# EAGLE design bd950_interface (EAGLE 7.7.0)

## Sheet 1 of 3
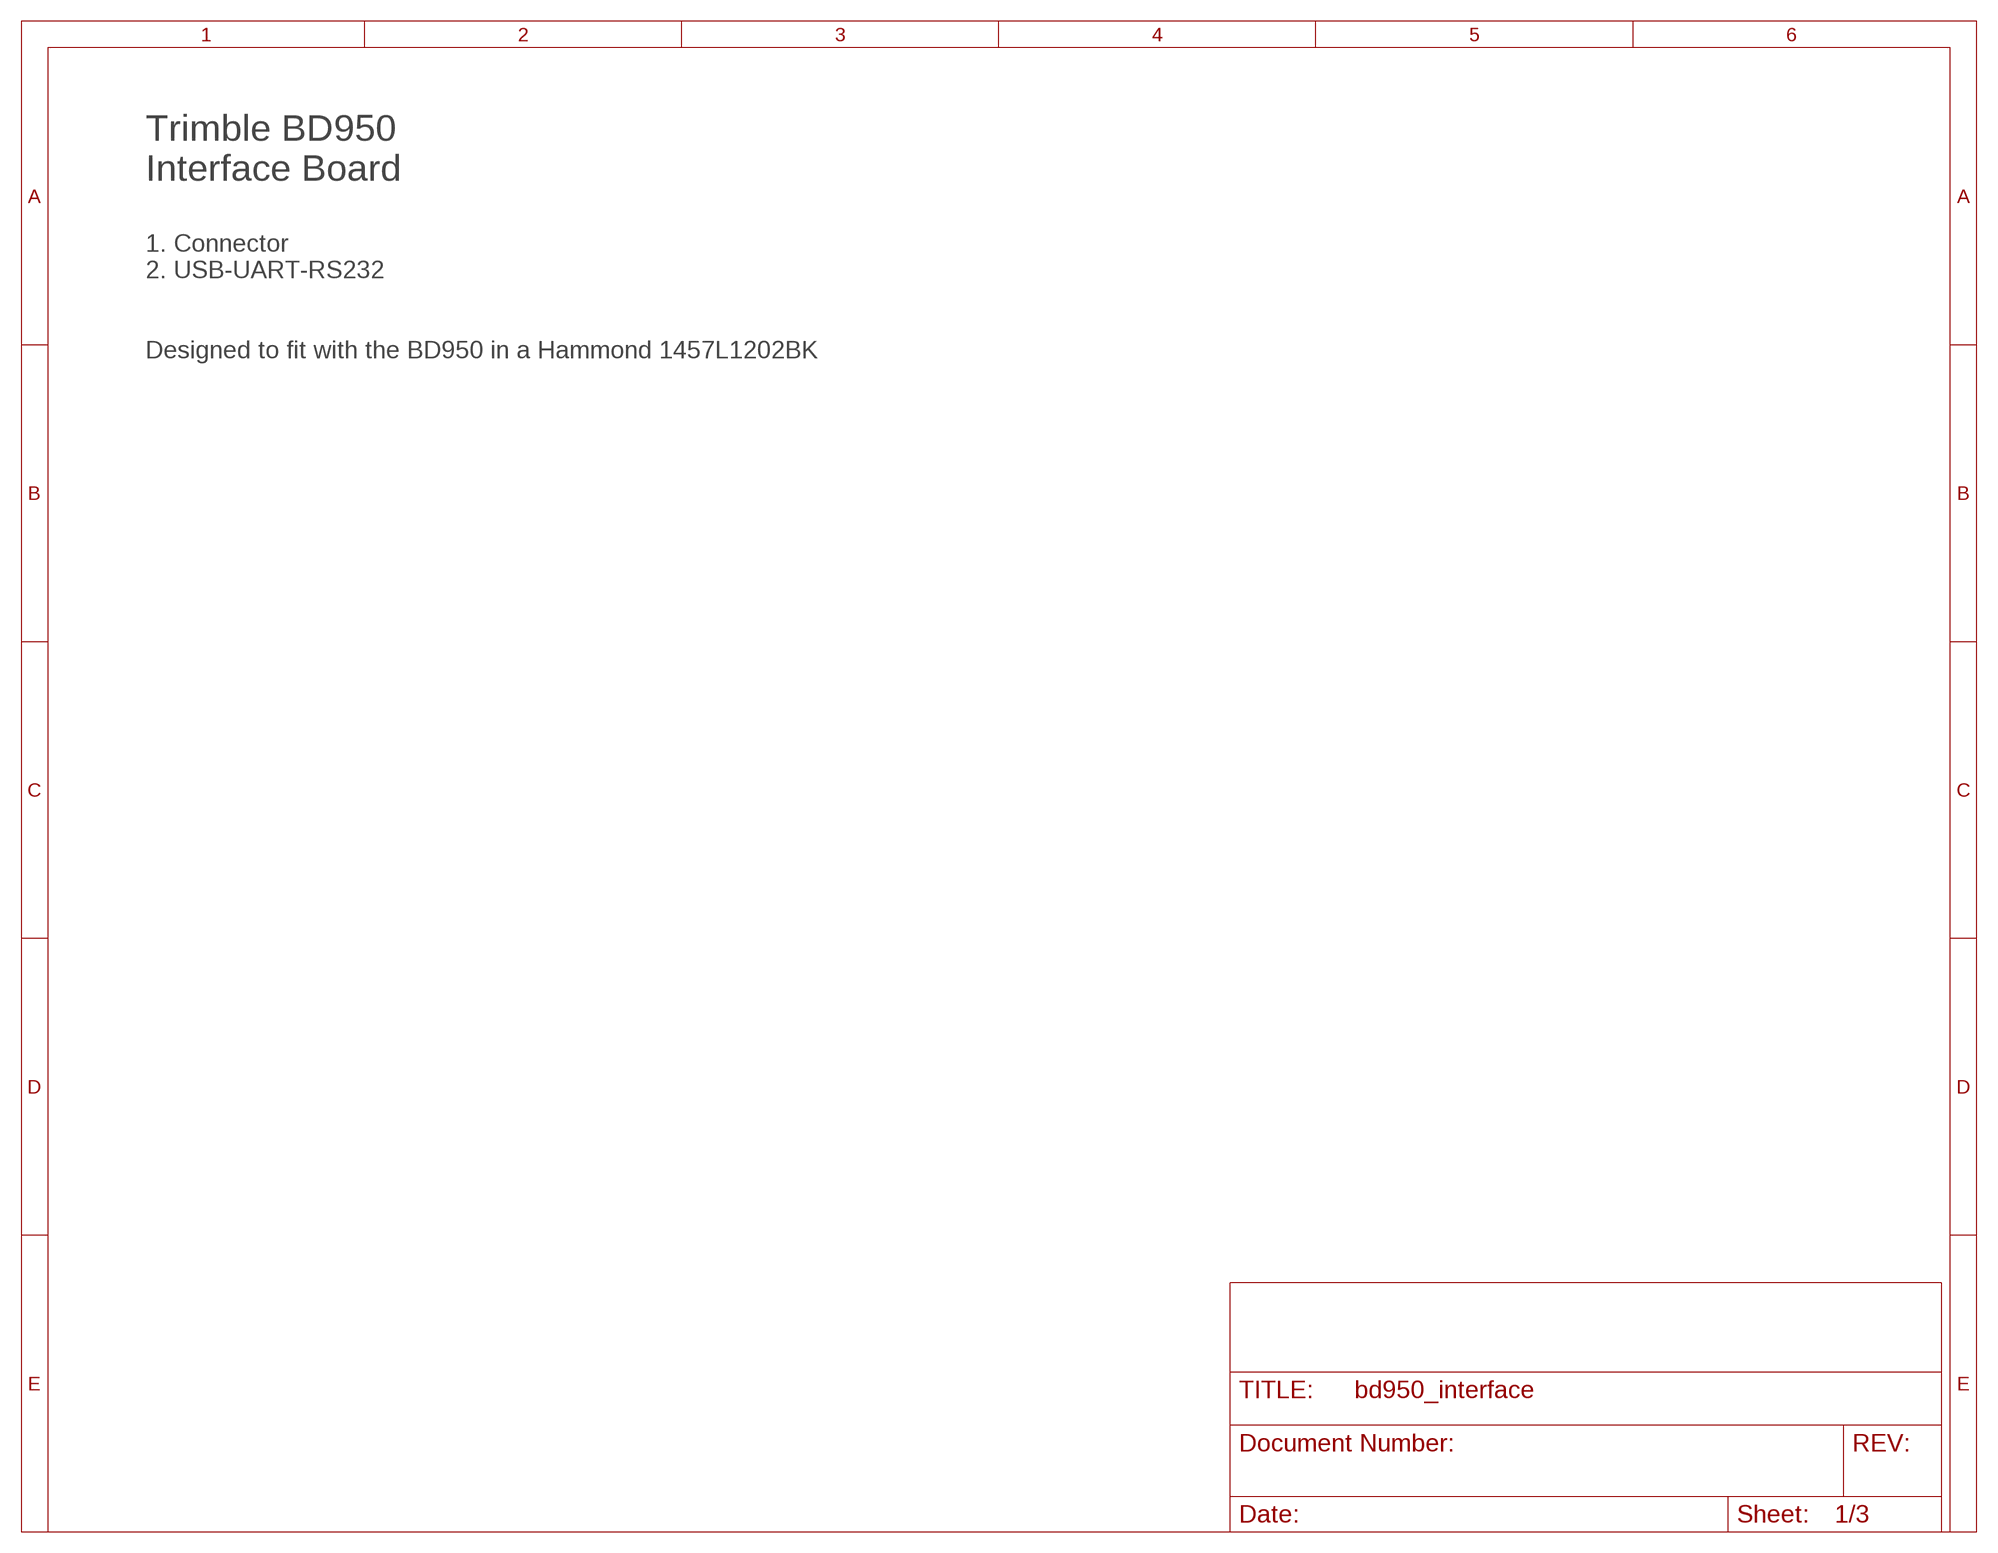
[diagram p0: schematic, sheet 1]

### Notes on the sheet
- Trimble BD950
  Interface Board
- 1. Connector
  2. USB-UART-RS232
- Designed to fit with the BD950 in a Hammond 1457L1202BK

## Sheet 2 of 3
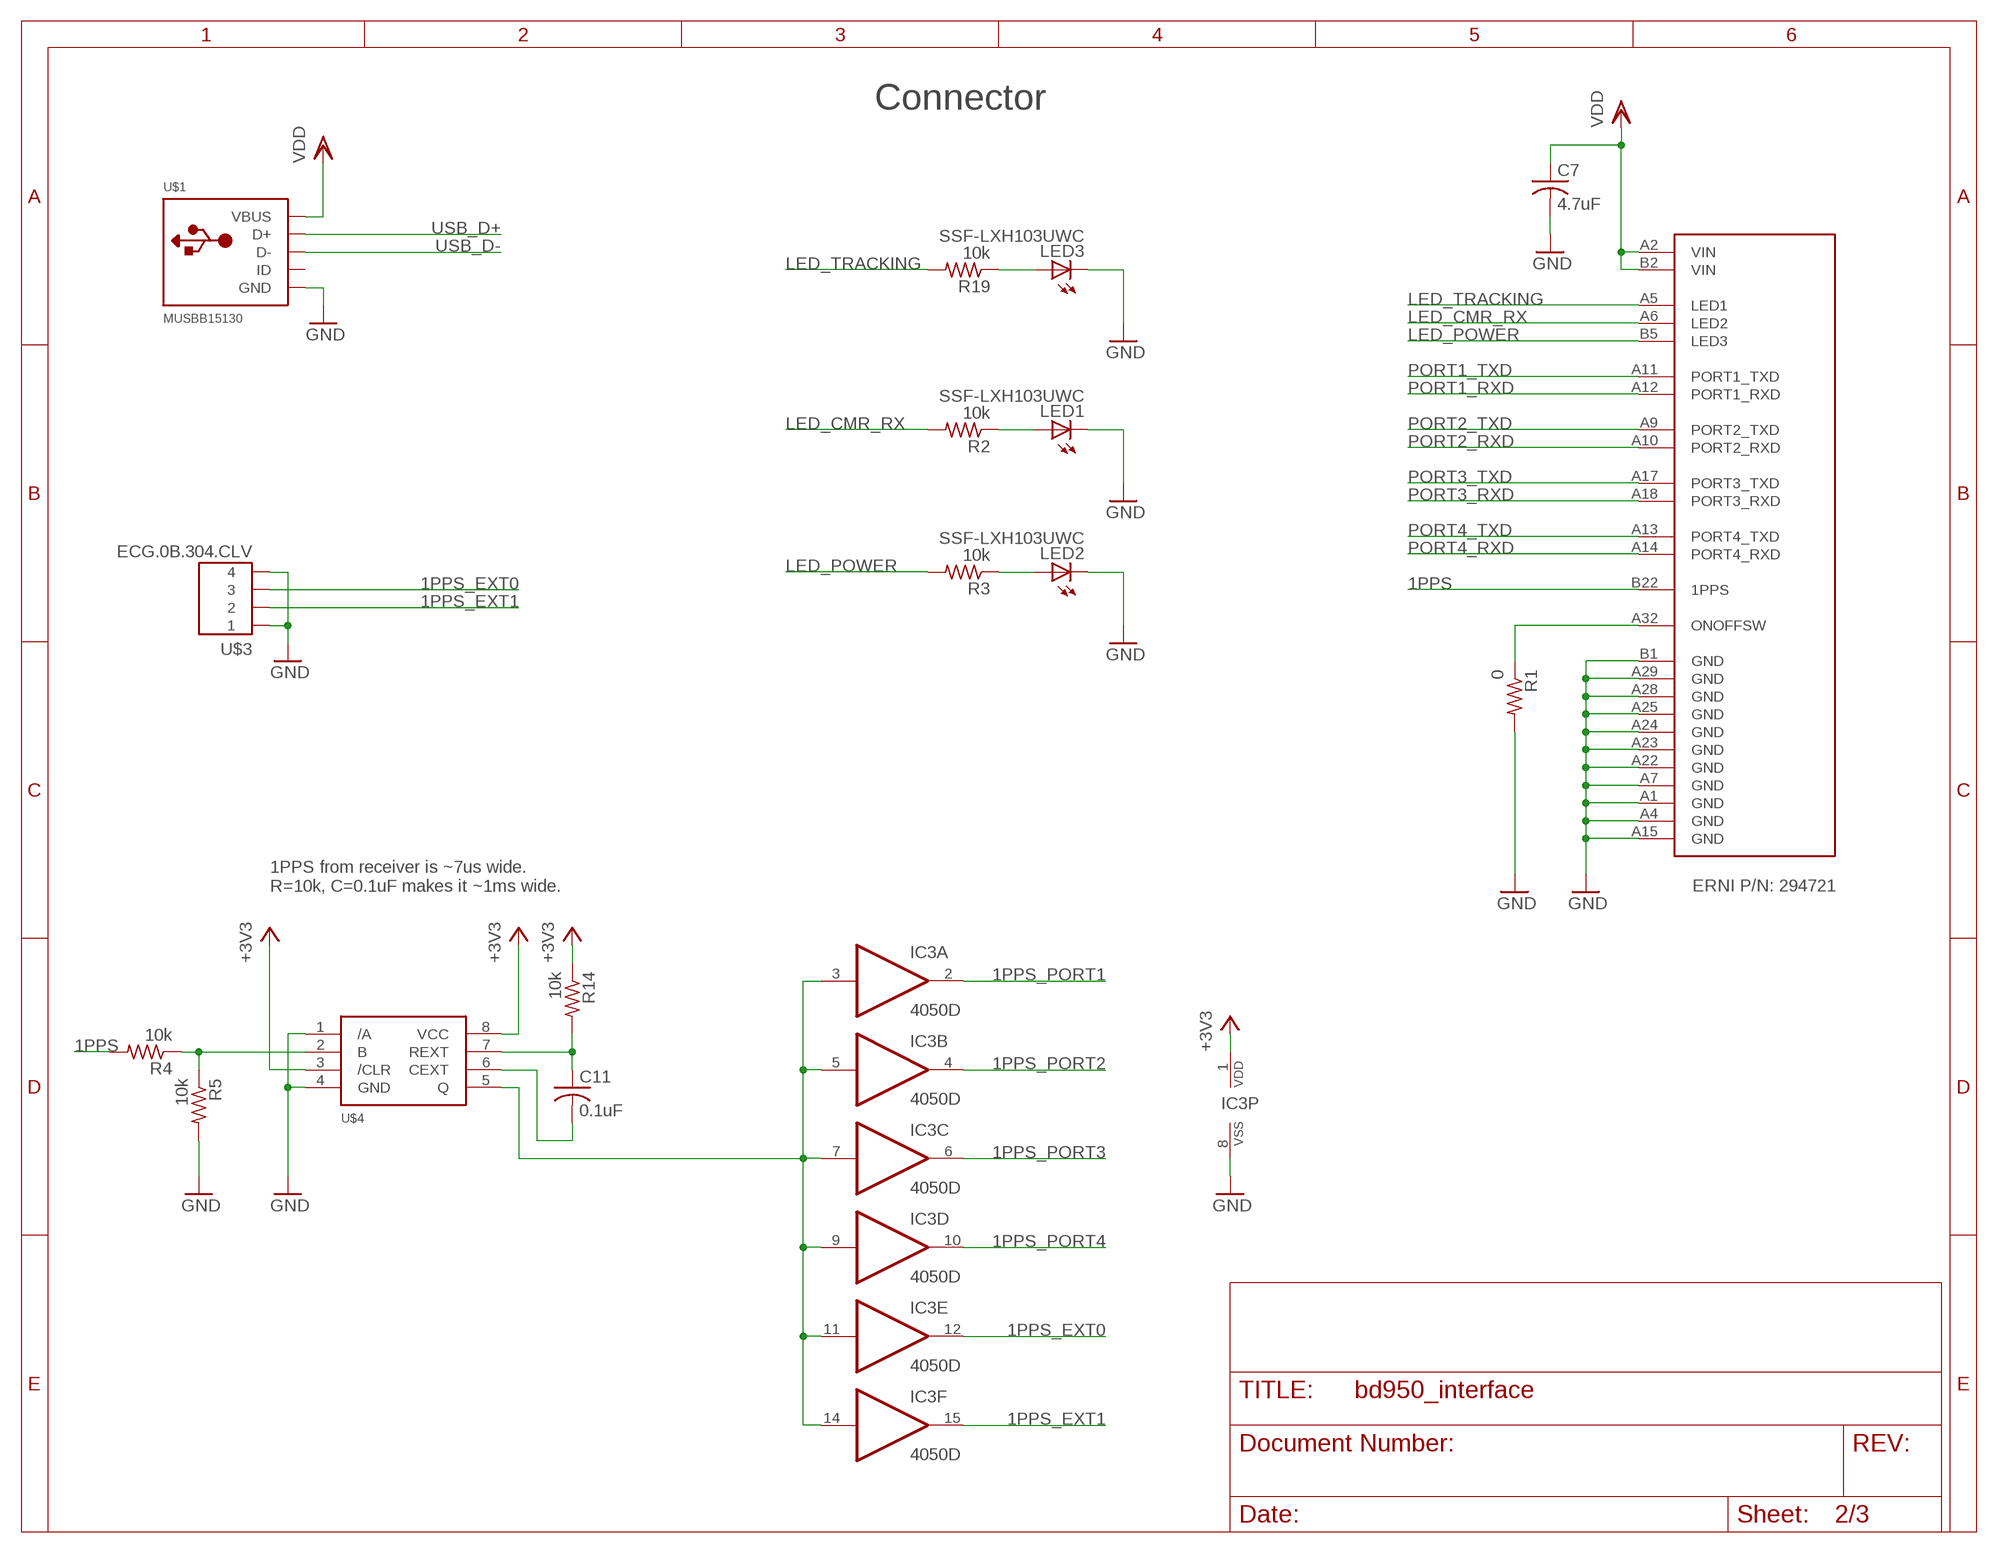
[diagram p1: schematic, sheet 2]

### Parts
C7  4.7uF  C-USC0805  [C0805]
C11  0.1uF  C-USC0603  [C0603]
IC3  4050D  [SO16]
LED1  SSF-LXH103UWC  LEDCHIP-LED0603  [CHIP-LED0603]
LED2  SSF-LXH103UWC  LEDCHIP-LED0603  [CHIP-LED0603]
LED3  SSF-LXH103UWC  LEDCHIP-LED0603  [CHIP-LED0603]
R1  0  R-US_R0603  [R0603]
R2  10k  R-US_R0603  [R0603]
R3  10k  R-US_R0603  [R0603]
R4  10k  R-US_R0603  [R0603]
R5  10k  R-US_R0603  [R0603]
R14  10k  R-US_R0603  [R0603]
R19  10k  R-US_R0603  [R0603]
U$1  MUSBB15130  [MUSBB15130]
U$2  294721  TRIMBLE_BD950  [TRIMBLE_BD950]
U$3  ECG.0B.304.CLV  ECG.0B.CLV  [ECG.0B.CLV]
U$4  SN74LVC1G123  [DCU_(R-PDSO-G8)]

### Nets
1PPS: R4.2 U$2.B22(1PPS)
1PPS_EXT0: IC3.12(E:O) U$3.P$4
1PPS_EXT1: IC3.15(F:O) U$3.P$3
1PPS_PORT1: IC3.2(A:O) ; also sheet 3
1PPS_PORT2: IC3.4(B:O) ; also sheet 3
1PPS_PORT3: IC3.6(C:O) ; also sheet 3
1PPS_PORT4: IC3.10(D:O) ; also sheet 3
+3V3: IC3.1(P:VDD) R14.1 U$4.3(/CLR) U$4.8(VCC) ; also sheet 3
GND: C7.2 IC3.8(P:VSS) LED1.C LED2.C LED3.C R1.2 R5.2 U$1.5(GND) U$2.A1(GND) U$2.A4(GND) U$2.A7(GND) U$2.A15(GND) U$2.A22(GND) U$2.A23(GND) U$2.A24(GND) U$2.A25(GND) U$2.A28(GND) U$2.A29(GND) U$2.B1(GND) U$3.P$1 U$3.P$2 U$4.1(/A) U$4.4(GND) ; also sheet 3
LED_CMR_RX: R2.2 U$2.A6(LED2)
LED_POWER: R3.2 U$2.B5(LED3)
LED_TRACKING: R19.2 U$2.A5(LED1)
N$1: LED1.A R2.1
N$3: R1.1 U$2.A32(ONOFFSW)
N$5: LED2.A R3.1
N$7: LED3.A R19.1
N$8: IC3.3(A:I) IC3.5(B:I) IC3.7(C:I) IC3.9(D:I) IC3.11(E:I) IC3.14(F:I) U$4.5(Q)
N$13: R4.1 R5.1 U$4.2(B)
N$21: C11.2 U$4.6(CEXT)
N$23: C11.1 R14.2 U$4.7(REXT)
PORT1_RXD: U$2.A12(PORT1_RXD) ; also sheet 3
PORT1_TXD: U$2.A11(PORT1_TXD) ; also sheet 3
PORT2_RXD: U$2.A10(PORT2_RXD) ; also sheet 3
PORT2_TXD: U$2.A9(PORT2_TXD) ; also sheet 3
PORT3_RXD: U$2.A18(PORT3_RXD) ; also sheet 3
PORT3_TXD: U$2.A17(PORT3_TXD) ; also sheet 3
PORT4_RXD: U$2.A14(PORT4_RXD) ; also sheet 3
PORT4_TXD: U$2.A13(PORT4_TXD) ; also sheet 3
USB_D+: U$1.3(D+) ; also sheet 3
USB_D-: U$1.2(D-) ; also sheet 3
VDD: C7.1 U$1.1(VBUS) U$2.A2(VIN) U$2.B2(VIN) ; also sheet 3
Unconnected: U$1.4(ID)

### Notes on the sheet
- Connector
- 1PPS from receiver is ~7us wide.
  R=10k, C=0.1uF makes it ~1ms wide.
- ERNI P/N: 294721

## Sheet 3 of 3
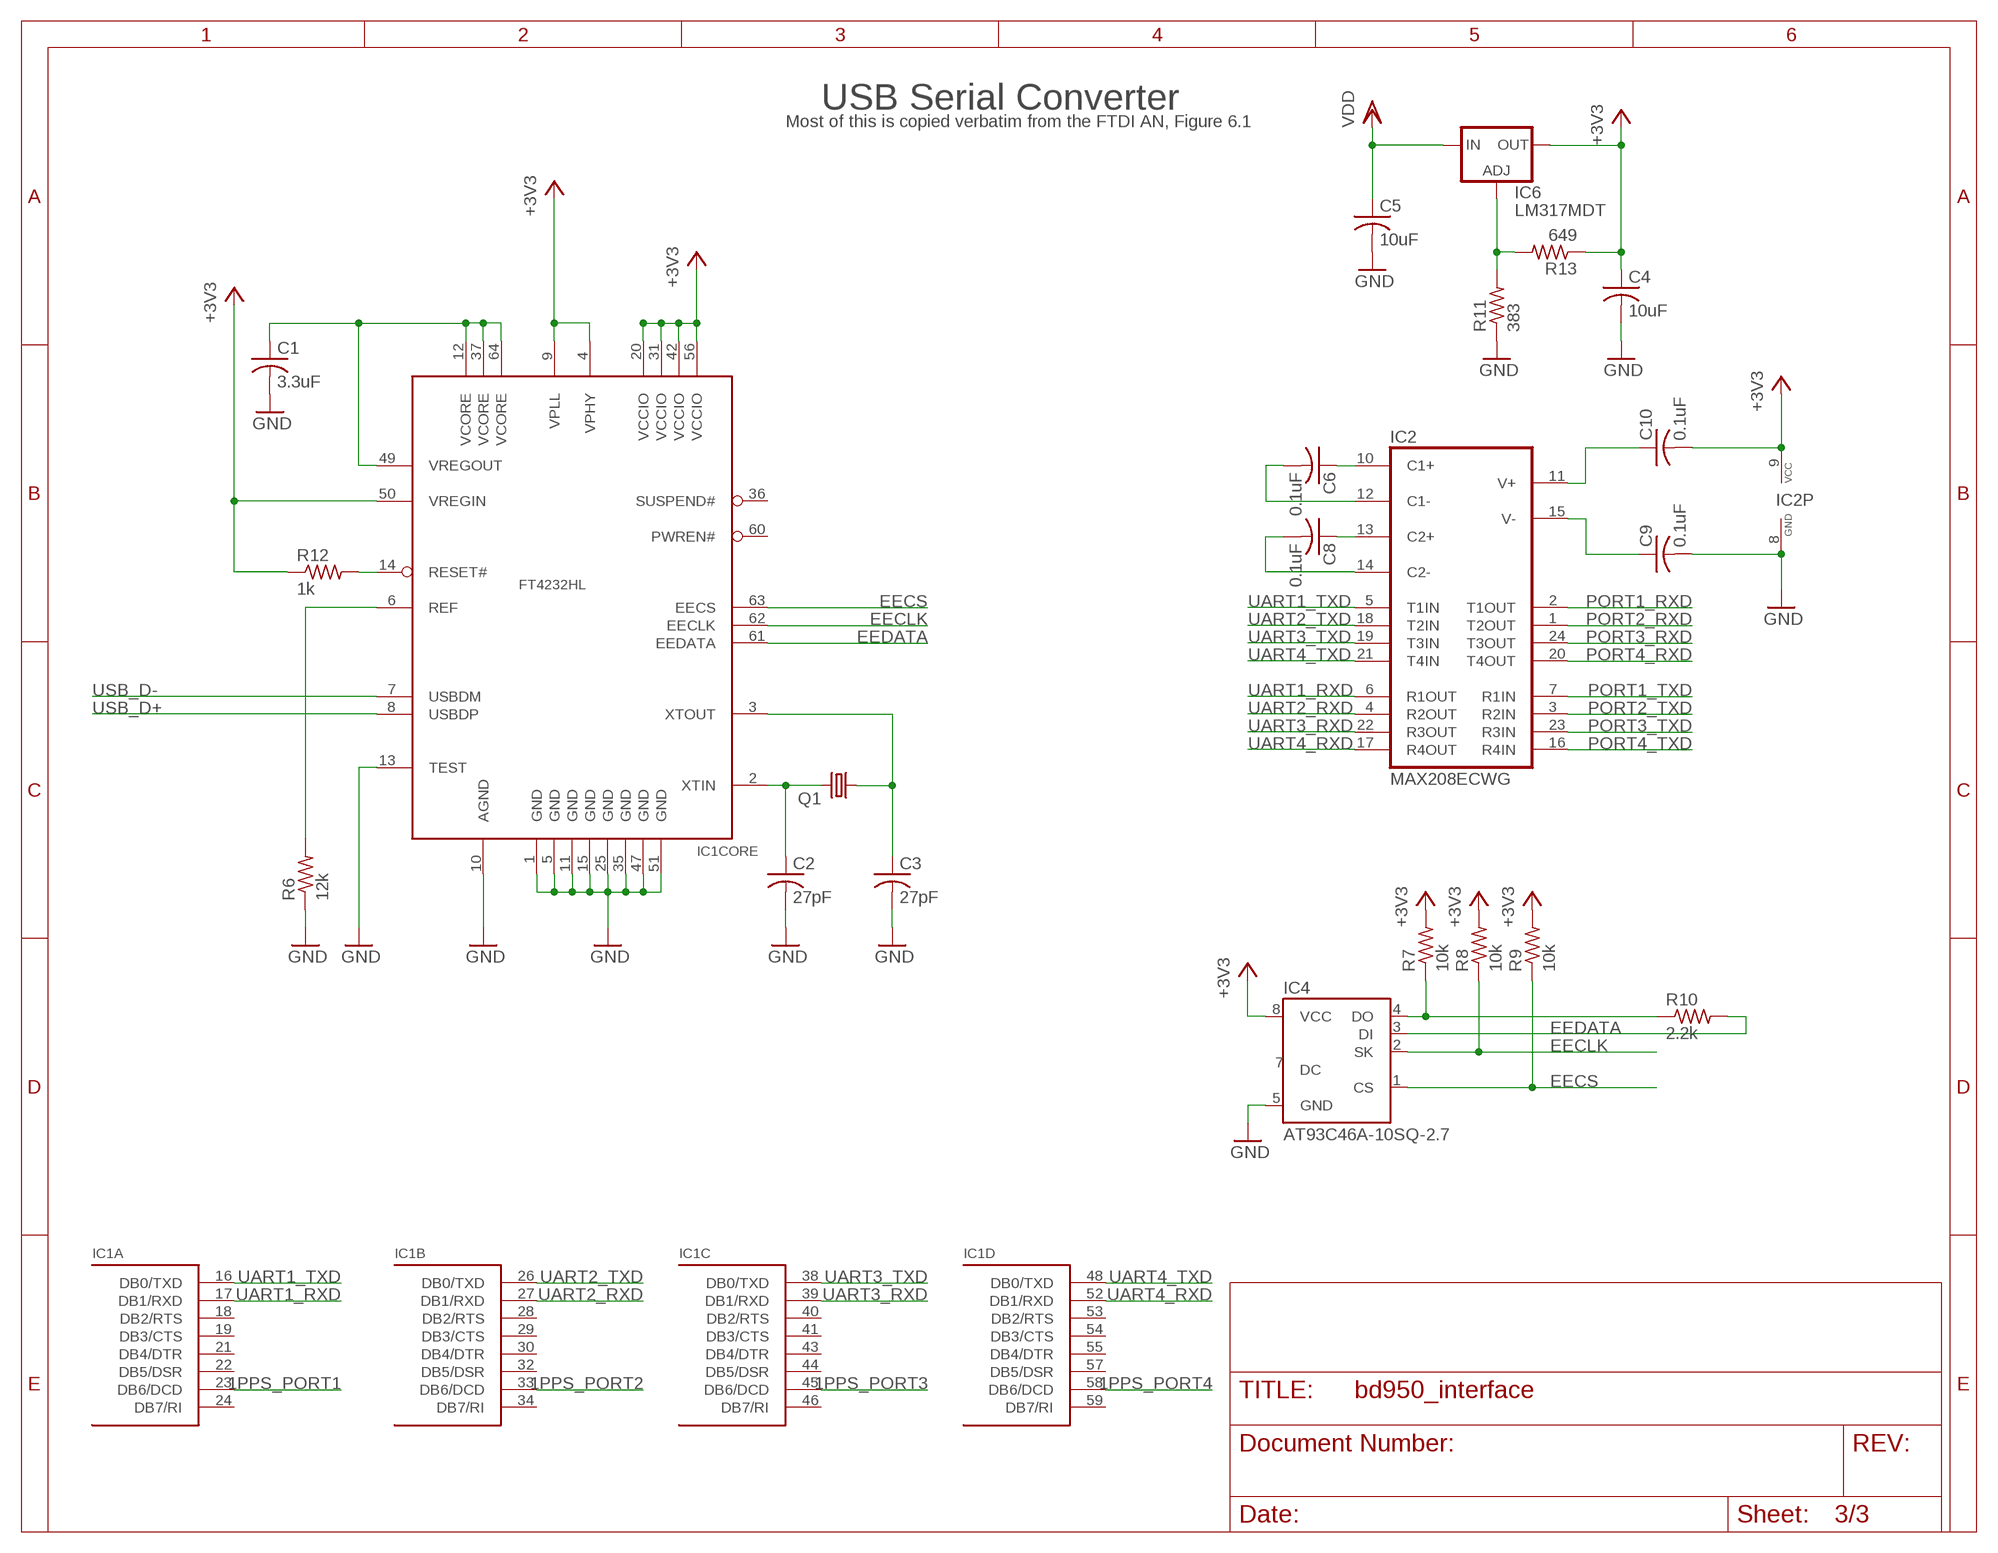
[diagram p2: schematic, sheet 3]

### Parts
C1  3.3uF  C-USC0603  [C0603]
C2  27pF  C-USC0603  [C0603]
C3  27pF  C-USC0603  [C0603]
C4  10uF  C-USC0805  [C0805]
C5  10uF  C-USC0805  [C0805]
C6  0.1uF  C-USC0603  [C0603]
C8  0.1uF  C-USC0603  [C0603]
C9  0.1uF  C-USC0603  [C0603]
C10  0.1uF  C-USC0603  [C0603]
IC1  FT4232HL  [LQFP64]
IC2  MAX208ECWG  [SO24L]
IC4  AT93C46A-10SQ-2.7  [SOIC8]
IC6  LM317MDT  [DPACK]
Q1  CRYSTALHC49S  [HC49/S]
R6  12k  R-US_R0603  [R0603]
R7  10k  R-US_R0603  [R0603]
R8  10k  R-US_R0603  [R0603]
R9  10k  R-US_R0603  [R0603]
R10  2.2k  R-US_R0603  [R0603]
R11  383  R-US_R0603  [R0603]
R12  1k  R-US_R0603  [R0603]
R13  649  R-US_R0603  [R0603]

### Nets
1PPS_PORT1: IC1.23(A:DB6/DCD) ; also sheet 2
1PPS_PORT2: IC1.33(B:DB6/DCD) ; also sheet 2
1PPS_PORT3: IC1.45(C:DB6/DCD) ; also sheet 2
1PPS_PORT4: IC1.58(D:DB6/DCD) ; also sheet 2
+3V3: C4.1 C10.2 IC1.4(CORE:VPHY) IC1.9(CORE:VPLL) IC1.20(CORE:VCCIO) IC1.31(CORE:VCCIO) IC1.42(CORE:VCCIO) IC1.50(CORE:VREGIN) IC1.56(CORE:VCCIO) IC2.9(VCC) IC4.8(VCC) IC6.4(OUT) R7.2 R8.2 R9.2 R12.1 R13.1 ; also sheet 2
EECLK: IC1.62(CORE:EECLK) IC4.2(SK) R8.1
EECS: IC1.63(CORE:EECS) IC4.1(CS) R9.1
EEDATA: IC1.61(CORE:EEDATA) IC4.3(DI) R10.2
GND: C1.2 C2.2 C3.2 C4.2 C5.2 C9.2 IC1.1(CORE:GND) IC1.5(CORE:GND) IC1.10(CORE:AGND) IC1.11(CORE:GND) IC1.13(CORE:TEST) IC1.15(CORE:GND) IC1.25(CORE:GND) IC1.35(CORE:GND) IC1.47(CORE:GND) IC1.51(CORE:GND) IC2.8(GND) IC4.5(GND) R6.1 R11.1 ; also sheet 2
N$2: IC6.1(ADJ) R11.2 R13.2
N$6: IC1.6(CORE:REF) R6.2
N$9: IC4.4(DO) R7.1 R10.1
N$10: C1.1 IC1.12(CORE:VCORE) IC1.37(CORE:VCORE) IC1.49(CORE:VREGOUT) IC1.64(CORE:VCORE)
N$11: C3.1 IC1.3(CORE:XTOUT) Q1.1
N$12: C2.1 IC1.2(CORE:XTIN) Q1.2
N$14: C6.1 IC2.10(C1+)
N$15: IC1.14(CORE:RESET#) R12.2
N$16: C6.2 IC2.12(C1-)
N$17: C8.1 IC2.13(C2+)
N$18: C8.2 IC2.14(C2-)
N$19: C9.1 IC2.15(V-)
N$20: C10.1 IC2.11(V+)
PORT1_RXD: IC2.2(T1OUT) ; also sheet 2
PORT1_TXD: IC2.7(R1IN) ; also sheet 2
PORT2_RXD: IC2.1(T2OUT) ; also sheet 2
PORT2_TXD: IC2.3(R2IN) ; also sheet 2
PORT3_RXD: IC2.24(T3OUT) ; also sheet 2
PORT3_TXD: IC2.23(R3IN) ; also sheet 2
PORT4_RXD: IC2.20(T4OUT) ; also sheet 2
PORT4_TXD: IC2.16(R4IN) ; also sheet 2
UART1_RXD: IC1.17(A:DB1/RXD) IC2.6(R1OUT)
UART1_TXD: IC1.16(A:DB0/TXD) IC2.5(T1IN)
UART2_RXD: IC1.27(B:DB1/RXD) IC2.4(R2OUT)
UART2_TXD: IC1.26(B:DB0/TXD) IC2.18(T2IN)
UART3_RXD: IC1.39(C:DB1/RXD) IC2.22(R3OUT)
UART3_TXD: IC1.38(C:DB0/TXD) IC2.19(T3IN)
UART4_RXD: IC1.52(D:DB1/RXD) IC2.17(R4OUT)
UART4_TXD: IC1.48(D:DB0/TXD) IC2.21(T4IN)
USB_D+: IC1.8(CORE:USBDP) ; also sheet 2
USB_D-: IC1.7(CORE:USBDM) ; also sheet 2
VDD: C5.1 IC6.3(IN) ; also sheet 2
Unconnected: IC1.18(A:DB2/RTS) IC1.19(A:DB3/CTS) IC1.21(A:DB4/DTR) IC1.22(A:DB5/DSR) IC1.24(A:DB7/RI) IC1.28(B:DB2/RTS) IC1.29(B:DB3/CTS) IC1.30(B:DB4/DTR) IC1.32(B:DB5/DSR) IC1.34(B:DB7/RI) IC1.36(CORE:SUSPEND#) IC1.40(C:DB2/RTS) IC1.41(C:DB3/CTS) IC1.43(C:DB4/DTR) IC1.44(C:DB5/DSR) IC1.46(C:DB7/RI) IC1.53(D:DB2/RTS) IC1.54(D:DB3/CTS) IC1.55(D:DB4/DTR) IC1.57(D:DB5/DSR) IC1.59(D:DB7/RI) IC1.60(CORE:PWREN#) IC4.6(NC) IC4.7(DC)

### Notes on the sheet
- USB Serial Converter
- Most of this is copied verbatim from the FTDI AN, Figure 6.1

## Library data of the parts
C1-C11 = resistor:C-US: CAPACITOR, American symbol
IC1 = ftdichip-6:FT4232H: Quad USB UART 5th generation USB to 4-port serial controller
IC2 = maxim:MAX208ECWG: RS232 TRANSCEIVER; MPN: MAX208ECWG+; OC_FARNELL: unknown; OC_NEWARK: 67K4386
IC3 = 40xx:4050: Hex non-inverting BUFFER
IC4 = atmel:AT93C46A-10?Q-2.7: Three-wire Automotive Temperature Serial EEPROM 1K (64 x 16) Source: http://www.atmel.com/dyn/resources/prod_documents/doc5089.pdf; MPN: AT93C46DN-SH-B; OC_FARNELL: 1455086; OC_NEWARK: 58M3879
IC6 = v-reg:LM317?*: 500 mA Adjustable Output Positive Voltage Regulator Source: http://www.onsemi.co.jp .. LM317M-D.PDF
LED1-LED3 = adafruit:LED: LED OSRAM: - CHIPLED LG R971, LG N971, LY N971, LG Q971, LY Q971, LO R971, LY R971 LH N974, LH R974 LS Q976, LO Q976, LY Q976 LO Q996 - Hyper CHIPLED LW Q18S LB Q993, LB Q99A, LB R99A - SideLED LS A670, LO A670, LY A670, LG A670, LP A670 LB A673, LV A673, LT A673, LW A673 LH A674 LY A675 LS A676, LA A676, LO A676, LY A676, LW A676 LS A679, LY A679, LG A679 - Hyper Micro SIDELED® LS Y876, LA Y876, LO Y876, LY Y876 LT Y87S - SmartLED LW L88C, LW L88S LB L89C, LB L89S, LG L890 LS L89K, LO L89K, LY L89K LS L896, LA L896, LO L896, LY L896 - TOPLED LS T670, LO T670, LY T670, LG T670, LP T670 LSG T670, LSP T670, LSY T670, LOP T670, LYG T670 LG T671, LOG T671, LSG T671 LB T673, LV T673, LT T673, LW T673 LH T674 LS T676, LA T676, LO T676, LY T676, LB T676, LH T676, LSB T676, LW T676 LB T67C, LV T67C, LT T67C, LS T67K, LO T67K, LY T67K, LW E67C LS E67B, LA E67B, LO E67B, LY E67B, LB E67C, LV E67C, LT E67C LW T67C LS T679, LY T679, LG T679 LS T770, LO T770, LY T770, LG T770, LP T770 LB T773, LV T773, LT T773, LW T773 LH T774 LS E675, LA E675, LY E675, LS T675 LS T776, LA T776, LO T776, LY T776, LB T776 LHGB T686 LT T68C, LB T68C - Hyper Mini TOPLED® LB M676 - Mini TOPLED Santana® LG M470 LS M47K, LO M47K, LY M47K Source: http://www.osram.convergy.de/
Q1 = adafruit:CRYSTAL: CRYSTAL; OC_FARNELL: 1667008; OC_NEWARK: unknown
R1-R5 R14 R19 = rcl:R-US_: RESISTOR, American symbol
R6-R13 = resistor:R-US_: RESISTOR, American symbol
U$1 = adafruit:MUSBB15130
U$2 = adafruit:TRIMBLE_BD950
U$3 = adafruit:ECG.0B.CLV
U$4 = adafruit:SN74LVC1G123

## Board
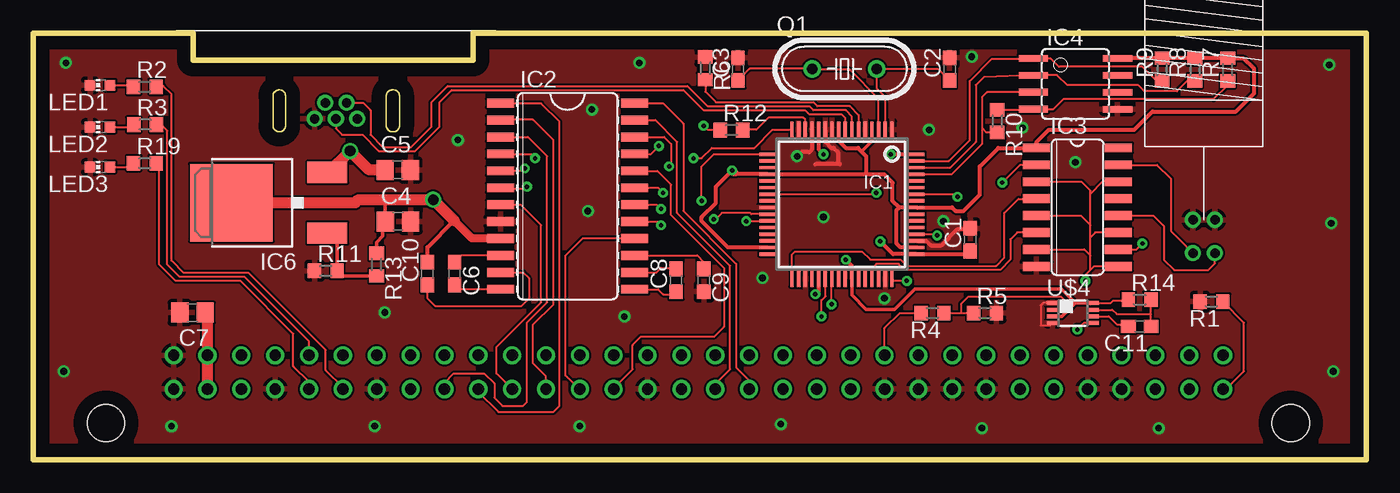
[diagram p3: board, top side]
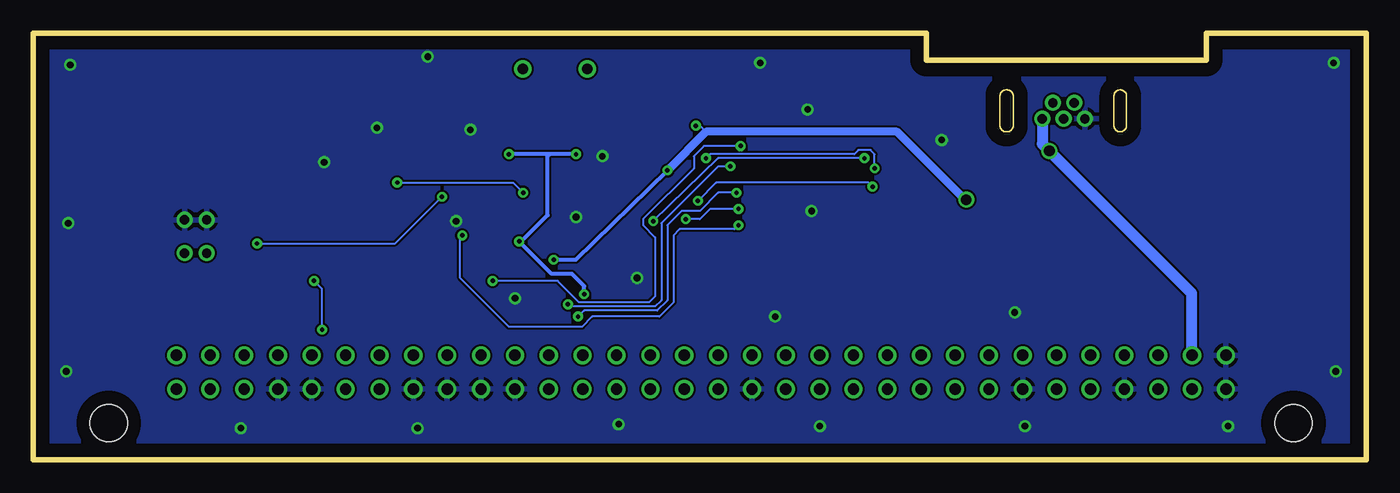
[diagram p4: board, bottom side, seen from below]

Size 100 x 32 mm. Coordinates in mm from the lower left corner, seen from the top.
Outline: 0,0 100,0 100,32 33,32 33,30 12,30 12,32 0,32 0,0
Copper layers (1*16): Top 0.035mm / dielectric 1.5mm / Bottom 0.035mm
Design rules "default *": minimum track width 6mil, minimum drill 13mil, track to track 6mil, track to pad 6mil, pad to pad 6mil, via to via 6mil, smd to smd 6mil, copper to edge 40mil, drill to drill 8mil, minimum pad ring 10mil, minimum via ring 8mil, stop-mask expansion 4mil, vias tented up to drill 0mil, thermal gap 10mil

### Footprints (pad centres in the part's own frame; a part is rotated, then mirrored left to right if it is on the bottom)
C0603 = smd 1.1 x 1: 1 -0.85,0; 2 0.85,0
C0805 = smd 1.3 x 1.5: 1 -0.95,0; 2 0.95,0
LQFP64 = smd 0.25 x 1.2: 1 -3.75,-5.6; 2 -3.25,-5.6; 3 -2.75,-5.6; 4 -2.25,-5.6; 5 -1.75,-5.6; 6 -1.25,-5.6; 7 -0.75,-5.6; 8 -0.25,-5.6; 9 0.25,-5.6; 10 0.75,-5.6; 11 1.25,-5.6; 12 1.75,-5.6; 13 2.25,-5.6; 14 2.75,-5.6; 15 3.25,-5.6; 16 3.75,-5.6; 33 3.75,5.6; 34 3.25,5.6; 35 2.75,5.6; 36 2.25,5.6; 37 1.75,5.6; 38 1.25,5.6; 39 0.75,5.6; 40 0.25,5.6; 41 -0.25,5.6; 42 -0.75,5.6; 43 -1.25,5.6; 44 -1.75,5.6; 45 -2.25,5.6; 46 -2.75,5.6; 47 -3.25,5.6; 48 -3.75,5.6 | smd 1.2 x 0.25: 17 5.6,-3.75; 18 5.6,-3.25; 19 5.6,-2.75; 20 5.6,-2.25; 21 5.6,-1.75; 22 5.6,-1.25; 23 5.6,-0.75; 24 5.6,-0.25; 25 5.6,0.25; 26 5.6,0.75; 27 5.6,1.25; 28 5.6,1.75; 29 5.6,2.25; 30 5.6,2.75; 31 5.6,3.25; 32 5.6,3.75; 49 -5.6,3.75; 50 -5.6,3.25; 51 -5.6,2.75; 52 -5.6,2.25; 53 -5.6,1.75; 54 -5.6,1.25; 55 -5.6,0.75; 56 -5.6,0.25; 57 -5.6,-0.25; 58 -5.6,-0.75; 59 -5.6,-1.25; 60 -5.6,-1.75; 61 -5.6,-2.25; 62 -5.6,-2.75; 63 -5.6,-3.25; 64 -5.6,-3.75
SO24L = smd 0.66 x 2.032: 1 -6.985,-5.029; 2 -5.715,-5.029; 3 -4.445,-5.029; 4 -3.175,-5.029; 5 -1.905,-5.029; 6 -0.635,-5.029; 7 0.635,-5.029; 8 1.905,-5.029; 9 3.175,-5.029; 10 4.445,-5.029; 11 5.715,-5.029; 12 6.985,-5.029; 13 6.985,5.029; 14 5.715,5.029; 15 4.445,5.029; 16 3.175,5.029; 17 1.905,5.029; 18 0.635,5.029; 19 -0.635,5.029; 20 -1.905,5.029; 21 -3.175,5.029; 22 -4.445,5.029; 23 -5.715,5.029; 24 -6.985,5.029
SO16 = smd 0.66 x 2.032: 1 -4.445,-3.073; 2 -3.175,-3.073; 3 -1.905,-3.073; 4 -0.635,-3.073; 5 0.635,-3.073; 6 1.905,-3.073; 7 3.175,-3.073; 8 4.445,-3.073; 9 4.445,3.073; 10 3.175,3.073; 11 1.905,3.073; 12 0.635,3.073; 13 -0.635,3.073; 14 -1.905,3.073; 15 -3.175,3.073; 16 -4.445,3.073
SOIC8 = smd 0.5 x 2.2: 1 -1.905,-3.154; 2 -0.645,-3.154; 3 0.625,-3.154; 4 1.895,-3.154; 5 1.905,3.154; 6 0.635,3.154; 7 -0.635,3.154; 8 -1.905,3.154
DPACK = smd 1.6 x 3: 1 -2.28,-4.8; 3 2.28,-4.8 | smd 5.8 x 6.2: 4 0,2.38
CHIP-LED0603 = smd 0.8 x 0.8: A 0,-0.75; C 0,0.75
HC49/S = drill 0.813: 1 -2.413,0; 2 2.413,0
R0603 = smd 1 x 1.1: 1 -0.85,0; 2 0.85,0
MUSBB15130 = drill 0.7: 1 -1.6,0.6; 2 -0.8,-0.6; 3 0,0.6; 4 0.8,-0.6; 5 1.6,0.6
TRIMBLE_BD950 = drill 0.85: A1 0,0; A2 2.54,0; A3 5.08,0; A4 7.62,0; A5 10.16,0; A6 12.7,0; A7 15.24,0; A8 17.78,0; A9 20.32,0; A10 22.86,0; A11 25.4,0; A12 27.94,0; A13 30.48,0; A14 33.02,0; A15 35.56,0; A16 38.1,0; A17 40.64,0; A18 43.18,0; A19 45.72,0; A20 48.26,0; A21 50.8,0; A22 53.34,0; A23 55.88,0; A24 58.42,0; A25 60.96,0; A26 63.5,0; A27 66.04,0; A28 68.58,0; A29 71.12,0; A30 73.66,0; A31 76.2,0; A32 78.74,0; B1 0,2.54; B2 2.54,2.54; B3 5.08,2.54; B4 7.62,2.54; B5 10.16,2.54; B6 12.7,2.54; B7 15.24,2.54; B8 17.78,2.54; B9 20.32,2.54; B10 22.86,2.54; B11 25.4,2.54; B12 27.94,2.54; B13 30.48,2.54; B14 33.02,2.54; B15 35.56,2.54; B16 38.1,2.54; B17 40.64,2.54; B18 43.18,2.54; B19 45.72,2.54; B20 48.26,2.54; B21 50.8,2.54; B22 53.34,2.54; B23 55.88,2.54; B24 58.42,2.54; B25 60.96,2.54; B26 63.5,2.54; B27 66.04,2.54; B28 68.58,2.54; B29 71.12,2.54; B30 73.66,2.54; B31 76.2,2.54; B32 78.74,2.54 | hole 2.8: -5.08,-2.54; 83.82,-2.54
ECG.0B.CLV = drill 0.7: P$1 0,0; P$2 1.65,0; P$3 0,-2.5; P$4 1.65,-2.5
DCU_(R-PDSO-G8) = smd 0.3 x 0.8: 1 -0.75,-1.55; 2 -0.25,-1.55; 3 0.25,-1.55; 4 0.75,-1.55; 5 0.75,1.55; 6 0.25,1.55; 7 -0.25,1.55; 8 -0.75,1.55

### Placement (x,y rotation side)
C1  70.29,16.51 90 top
C2  68.75,29.3 90 top
C3  52.87,29.3 90 top
C4  27.35,17.88 0 top
C5  27.34,21.74 0 top
C6  31.6,13.96 270 top
C7  11.94,11.04 180 top
C8  48.22,13.45 90 top
C9  50.31,13.45 270 top
C10  29.57,13.96 90 top
C11  83,10 180 top
IC1  60.67,19.17 180 top
IC2  40.08,19.77 270 top
IC3  78.34,18.95 270 top
IC4  78.19,28.2 270 top
IC6  17.25,19.28 90 top
LED1  5,28.1 90 top
LED2  5,24.95 90 top
LED3  5,21.95 90 top
Q1  60.86,29.33 0 top
R1  88.39,11.85 180 top
R2  8.37,27.99 0 top
R3  8.39,25.15 0 top
R4  67.46,11 180 top
R5  71.4,11 0 top
R6  50.42,29.37 270 top
R7  89.61,29.28 90 top
R8  87.15,29.28 90 top
R9  84.68,29.28 90 top
R10  72.32,25.41 270 top
R11  21.95,14.17 0 top
R12  52.38,24.73 0 top
R13  25.76,14.63 270 top
R14  83,12 0 top
R19  8.37,22.24 0 top
U$1  22.7,26.18 180 top
U$2  10.53,5.29 0 top
U$3  87,18 0 top
U$4  78,11 270 top

### Tracks (layer width: path | path; a pad name or v marks a point on that pad's centre or on a via)
1PPS
  Top 0.152: U$2.B22 63.87,9.87 65,11 R4.2
1PPS_EXT0
  Top 0.152: IC3.12 84.05,18.32 84.84,17.53 84.84,14.99 85.6,14.22 88.14,14.22 88.65,14.73 U$3.P$4
1PPS_EXT1
  Top 0.152: IC3.15 84.3,22.12 85.34,21.08 85.34,17.16 U$3.P$3
1PPS_PORT1  (via drill 0.33)
  Top 0.152: IC3.2 74.03,22.12 v72.69,20.79 | IC1.23 63.14,19.92 v63.25,20.03
  Bottom 0.152: v72.69,20.79 64.01,20.79 v63.25,20.03
1PPS_PORT2
  Top 0.152: IC1.33 56.92,15.38 57.15,15.61 62.18,15.61 62.79,15 65.08,15 65.53,14.54 72.24,14.54 72.85,15.15 72.85,18.51 73.91,19.57 75.26,19.57 IC3.4
1PPS_PORT3
  Top 0.152: IC3.6 73.82,17.05 73.3,16.53 73.3,15 72.54,14.24 65.38,14.24 64.92,14.7 63.25,14.7 62.94,14.39 62.94,13.6 IC1.45
1PPS_PORT4  (via drill 0.33)
  Top 0.152: IC3.10 82.76,15.78 v83.21,16.22 | IC1.58 69.14,19.92 v69.34,19.73
  Bottom 0.152: v83.21,16.22 72.85,16.22 v69.34,19.73
+3V3  (via drill 0.33, 0.8)
  Top 0.152: R12.1 50.62,24.73 v50.29,25.06 | U$4.8 80.84,11.75 81.03,11.94 82.09,11.94 R14.1
  Top 0.254: IC1.4 62.92,23.9 62.14,23.12 | U$4.8 78.17,11.75 | 78.17,11.75 77.11,12.8 66.14,12.8 64.62,11.28 62.48,11.28 61.42,12.35 IC1.42 | U$4.3 77.17,10.75 78.17,11.75 | 26.21,19.51 26.41,19.32 C4.1 26.21,17.69 26.21,16.76 25.76,16.31 R13.1
  Top 0.305: 62.48,21.42 IC1.20 52.71,21.42 v52.43,21.71 51.21,20.49 51.21,19.27 50.14,18.2 50.14,17.9 52.11,15.92 IC1.31 | 62.48,21.42 63.83,21.42 64.47,20.79 64.47,19.42 64.96,18.92 | 64.96,18.92 IC1.56 68.92,18.92 69.19,18.66 69.8,18.66 71.02,19.88 71.02,22.01 72.39,23.38 75.26,23.38 IC3.1 75.27,23.82 76.2,24.76 82.6,24.76 83.97,26.13 90.22,26.13 91.59,27.5 91.59,29.33 90.83,30.09 89.66,30.09 R7.2 R8.2 R9.2 81.36,30.13 IC4.8 | IC1.42 61.42,14.55 v60.96,15 | C10.2 29.57,15.92 31.58,17.93 | IC1.9 60.42,23.93 60.96,23.38 61.87,23.38 62.14,23.12 62.48,22.77 62.48,21.42 | IC1.50 65.07,15.92 64.77,16.22 64.77,18.73 64.96,18.92
  Top 0.61: v52.43,21.71 52.58,21.55 | IC2.9 32.91,16.59 31.58,17.93
  Top 0.813: IC6.4 24.16,19.28 24.38,19.51 26.21,19.51 v30,19.51 31.58,17.93
  Bottom 0.152: v50.29,25.06 49.99,25.06 49.53,24.6
  Bottom 0.305: v60.96,15 59.28,15 v52.43,21.71 52.58,21.86
  Bottom 0.61: v52.43,21.71 49.53,24.6 35.2,24.6 30.11,19.51 v30,19.51
EECLK
  Top 0.152: IC1.62 68.8,21.92 70.71,23.84 70.71,28.11 71.3,28.7 IC4.2 75.06,28.87 76.81,28.87 77.57,28.11 82.91,28.11 83.36,27.65 85.8,27.65 86.58,28.43 R8.1
EECS
  Top 0.152: IC1.63 68.69,22.42 70.26,23.99 70.26,28.41 71.93,30.09 75.02,30.09 IC4.1 75.05,30.09 76.35,30.09 76.96,29.48 83.21,29.48 84.26,28.43 R9.1
EEDATA
  Top 0.152: IC4.3 71.55,27.58 71.17,27.19 71.17,24.91 | 71.17,24.91 71.17,23.69 68.91,21.42 IC1.61 | R10.2 71.52,24.56 71.17,24.91
GND  (via drill 0.5)
  Top 0.152: U$4.1 75.76,11.75 75.59,11.58 75.59,10.06 76.26,10.06 U$4.4
  Top 0.305: IC1.51 67.01,16.42 67.36,16.07 68.12,16.07 69.34,17.29 70.22,17.29 C1.2 | IC1.11 59.42,23.86 59.89,23.38 60.05,23.38 60.35,23.08 60.35,22.32 60.5,22.16 58.67,22.16 | IC1.13 58.42,23.28 58.22,23.08 57.61,23.08 v57.3,22.77
  other vias: 97.23,29.63 78.18,22.32 74.22,24.91 70.41,30.24 45.47,29.78 41.61,18.66 31.85,23.99 26.37,11.04 2.44,29.78 2.29,6.62 10.36,2.51 25.6,2.51 41,2.51 56.08,2.66 71.17,2.35 84.43,2.35 97.54,6.62 97.38,17.75 59.28,18.2 68.28,17.9 54.71,13.63 44.35,10.73 41.91,26.28 67.21,24.76 63.86,12.11
  pour Bottom: 0,-1.06 -1.22,40.3 101.7,49.38 100.33,-1.22
  pour Top: -0.02,33.03 0,-1.05 100.03,-1.05 100.01,33.03
LED_CMR_RX
  Top 0.152: U$2.A6 23.23,5.43 21.95,6.71 21.95,8.23 16.15,14.02 11.28,14.02 10.36,14.94 10.36,27.43 9.75,28.04 9.28,28.04 R2.2
LED_POWER
  Top 0.152: U$2.B5 20.68,8.88 15.85,13.72 10.97,13.72 10.06,14.63 10.06,24.69 9.75,24.99 9.39,24.99 R3.2
LED_TRACKING
  Top 0.152: U$2.A5 20.68,5.83 19.51,7.01 19.51,9.45 15.54,13.41 10.67,13.41 9.45,14.63 9.45,22.02 R19.2
N$1
  Top 0.152: LED1.A 7.42,28.1 R2.1
N$2
  Top 0.254: R13.2 23.19,13.78 R11.2 22.8,16.25 IC6.1
N$3
  Top 0.152: U$2.A32 89.5,5.29 90.83,6.62 90.83,10.26 R1.1
N$5
  Top 0.152: LED2.A 7.34,24.95 R3.1
N$6
  Top 0.152: R6.2 50.42,27.61 51.21,26.82 58.52,26.82 58.83,26.52 61.27,26.52 61.92,25.87 IC1.6
N$7
  Top 0.152: LED3.A 7.23,21.95 R19.1
N$8  (via drill 0.33)
  Top 0.152: 79.31,14.24 79.31,15.31 | 79.31,15.31 79.31,16.68 | 79.31,16.68 79.31,17.59 | 79.31,17.59 79.31,19.95 | 79.31,19.95 80.22,20.86 IC3.14 | IC3.9 79.58,14.51 79.31,14.24 | IC3.11 79.68,17.05 79.31,16.68 | IC3.7 78.85,15.78 79.31,15.31 | IC3.3 78.64,20.86 79.31,20.18 79.31,19.95 | IC3.5 78.59,18.32 79.31,17.59 | U$4.5 78.83,10.25 v78.33,9.75 | v78.94,13.41 78.94,13.87 79.31,14.24
  Bottom 0.152: v78.33,9.75 78.33,12.8 v78.94,13.41
N$9
  Top 0.152: R7.1 89.61,28.11 88.54,27.04 77.27,27.04 76.5,26.28 75.06,26.28 IC4.4 74.99,26.26 R10.1
N$10  (via drill 0.33)
  Top 0.305: C1.1 70.06,15.42 IC1.49 64.5,15.42 v63.55,16.37 | IC1.37 58.92,12.65 v58.67,12.41 | IC1.12 58.92,23.29 v59.28,22.93 | v64.31,22.93 IC1.64
  Bottom 0.305: v58.67,12.41 58.67,13.02 59.59,13.94 61.11,13.94 v63.55,16.37 63.4,16.37 61.42,18.36 61.42,22.77 61.27,22.93 | v59.28,22.93 61.27,22.93 | 61.27,22.93 v64.31,22.93
N$11
  Top 0.152: C3.1 53.75,29.33 Q1.1 58.51,29.26 61.27,29.26 63.42,27.11 IC1.3
N$12
  Top 0.152: C2.1 67.87,29.33 Q1.2 63.27,27.87 63.92,27.22 IC1.2
N$13
  Top 0.152: R4.1 69.6,11 | 69.6,11 R5.1 | 69.6,11 69.6,11.68 70.1,12.19 77.11,12.19 77.42,11.89 77.42,11.58 77.09,11.25 U$4.2
N$14
  Top 0.152: IC2.10 32.12,15.32 C6.1
N$15
  Top 0.152: IC1.14 57.92,25.51 57.76,25.67 55.17,25.67 54.25,24.76 53.25,24.76 R12.2
N$16
  Top 0.152: IC2.12 31.93,12.79 C6.2
N$17
  Top 0.152: IC2.13 46.87,12.79 47.24,12.41 48.03,12.41 C8.1
N$18
  Top 0.152: IC2.14 46.75,14.05 47.09,14.39 48.13,14.39 C8.2
N$19
  Top 0.152: IC2.15 49.82,15.32 50.29,14.85 50.29,14.31 C9.1
N$20
  Top 0.152: IC2.11 36.76,14.05 37.19,13.63 37.19,12.11 36.58,11.5 30.18,11.5 29.57,12.11 C10.1
N$21
  Top 0.152: U$4.6 80.69,10.75 81.28,10.16 81.99,10.16 C11.2
N$23
  Top 0.152: C11.1 83.85,10.92 | 83.85,10.92 R14.2 | U$4.7 80.95,11.25 81.28,10.92 83.85,10.92
PORT1_RXD
  Top 0.152: IC2.2 35.09,25.52 37.49,25.52 39.01,23.99 39.01,11.65 37.49,10.12 37.49,7.23 38.47,6.25 U$2.A12
PORT1_TXD
  Top 0.152: IC2.7 35.07,19.12 36.58,19.12 38.1,17.59 38.1,11.8 34.75,8.45 34.75,6.47 U$2.A11 | U$2.A11
PORT2_RXD
  Top 0.152: U$2.A10 33.38,5.09 34.9,3.57 39.01,3.57 39.47,4.03 39.47,25.36 38.1,26.74 35.07,26.74 IC2.1
PORT2_TXD
  Top 0.152: U$2.A9 30.84,5.77 31.55,6.47 33.83,6.47 34.59,5.71 34.59,4.64 35.2,4.03 36.73,4.03 37.03,4.33 37.03,10.28 38.56,11.8 38.56,22.77 37.12,24.21 IC2.3
PORT3_RXD
  Top 0.152: U$2.A18 53.7,5.95 52.73,6.92 52.73,14.7 48.77,18.66 48.77,25.21 47.23,26.75 IC2.24
PORT3_TXD
  Top 0.152: U$2.A17 51.16,5.66 52.27,6.77 52.27,14.54 48.31,18.51 48.31,23.84 46.67,25.48 IC2.23
PORT4_RXD
  Top 0.152: U$2.A14 43.55,5.36 44.96,6.77 44.96,8.6 45.57,9.21 51.05,9.21 51.82,9.97 51.82,14.39 47.85,18.36 47.85,20.64 46.82,21.68 IC2.20
PORT4_TXD
  Top 0.152: U$2.A13 40.85,5.39 39.93,6.32 39.93,15.31 41.22,16.59 IC2.16
UART1_RXD  (via drill 0.33)
  Top 0.152: v50.14,19.42 50.14,22.01 51.05,22.93 55.02,22.93 IC1.17 | v37.03,20.49 36.88,20.34 35.2,20.34 IC2.6
  Bottom 0.152: v50.14,19.42 48.77,20.79 37.34,20.79 v37.03,20.49
UART1_TXD  (via drill 0.33)
  Top 0.152: v49.53,22.62 50.14,22.62 50.9,23.38 54.1,23.38 55.47,24.76 56.84,24.76 IC1.16 | v36.88,21.86 36.58,21.71 35.2,21.71 IC2.5
  Bottom 0.152: v49.53,22.62 49.23,22.93 38.41,22.93 38.1,23.23 37.19,23.23 36.88,22.93 v36.88,21.86
UART2_RXD  (via drill 0.33)
  Top 0.152: v37.64,22.62 37.34,22.93 35.2,22.93 IC2.4 | v53.49,17.9 55.02,17.9 IC1.27
  Bottom 0.152: v53.49,17.9 48.62,22.62 v37.64,22.62
UART2_TXD  (via drill 0.33)
  Top 0.152: IC2.18 46.77,19.14 v47.09,18.81 | v51.05,18.05 51.21,18.05 51.66,18.51 53.8,18.51 53.88,18.42 IC1.26
  Bottom 0.152: v47.09,18.81 49.23,18.81 49.99,18.05 v51.05,18.05
UART3_RXD  (via drill 0.33)
  Top 0.152: IC2.22 47.33,24.21 47.85,23.69 47.85,22.16 v47.7,22.01 | v59.89,11.65 59.89,13.55 IC1.39
  Bottom 0.152: v47.7,22.01 48.62,22.01 52.88,17.75 52.88,11.95 53.34,11.5 59.74,11.5 v59.89,11.65
UART3_TXD  (via drill 0.33)
  Top 0.152: IC2.19 46.87,20.41 v47.24,20.03 | v59.13,10.73 59.13,11.95 59.44,12.26 59.44,13.55 IC1.38
  Bottom 0.152: v47.24,20.03 48.62,20.03 49.99,18.66 51.36,18.66 52.43,17.59 52.43,11.95 53.19,11.19 58.67,11.19 v59.13,10.73
UART4_RXD  (via drill 0.33)
  Top 0.152: IC2.17 46.82,17.86 v47.09,17.59 | IC1.52 67.72,16.92 v67.82,16.83
  Bottom 0.152: v47.09,17.59 47.4,17.29 51.51,17.29 51.97,16.83 51.97,11.8 53.03,10.73 58.06,10.73 58.83,9.97 64.31,9.97 67.97,13.63 67.97,16.68 v67.82,16.83
UART4_TXD  (via drill 0.33)
  Top 0.152: IC2.21 46.35,22.95 v46.94,23.54 | v65.53,13.41 64.58,13.41 IC1.48
  Bottom 0.152: v46.94,23.54 49.68,23.54 50.44,22.77 50.44,21.86 54.25,18.05 54.25,17.59 53.34,16.68 53.34,12.26 53.8,11.8 59.05,11.8 60.66,13.41 v65.53,13.41
USB_D+
  Top 0.152: U$1.3 22.7,24.85 23.16,24.38 24.69,24.38 25.91,23.16 28.65,23.16 30.48,24.99 30.48,26.82 31.39,27.74 48.77,27.74 50.29,26.21 57.91,26.21 58.22,25.91 60.66,25.91 60.92,25.65 IC1.8
USB_D-
  Top 0.152: IC1.7 61.42,25.76 60.96,26.21 58.52,26.21 58.22,26.52 50.6,26.52 49.07,28.04 31.09,28.04 29.87,26.82 29.87,24.99 28.35,23.47 26.21,23.47 25.3,24.38 25.3,26.21 24.73,26.78 U$1.2
VDD  (via drill 0.8)
  Top 0.813: U$2.A2 U$2.B2 13.06,10.86 C7.1 | IC6.3 22.17,21.56 v23.77,23.16 25.2,21.74 C5.1
  Bottom 0.813: U$1.1 24.3,23.69 24.08,23.47 v23.77,23.16 13.11,12.5 13.11,7.87 U$2.B2